# EAGLE design I-GAUGE solar v1-1 (EAGLE 7.5.0)
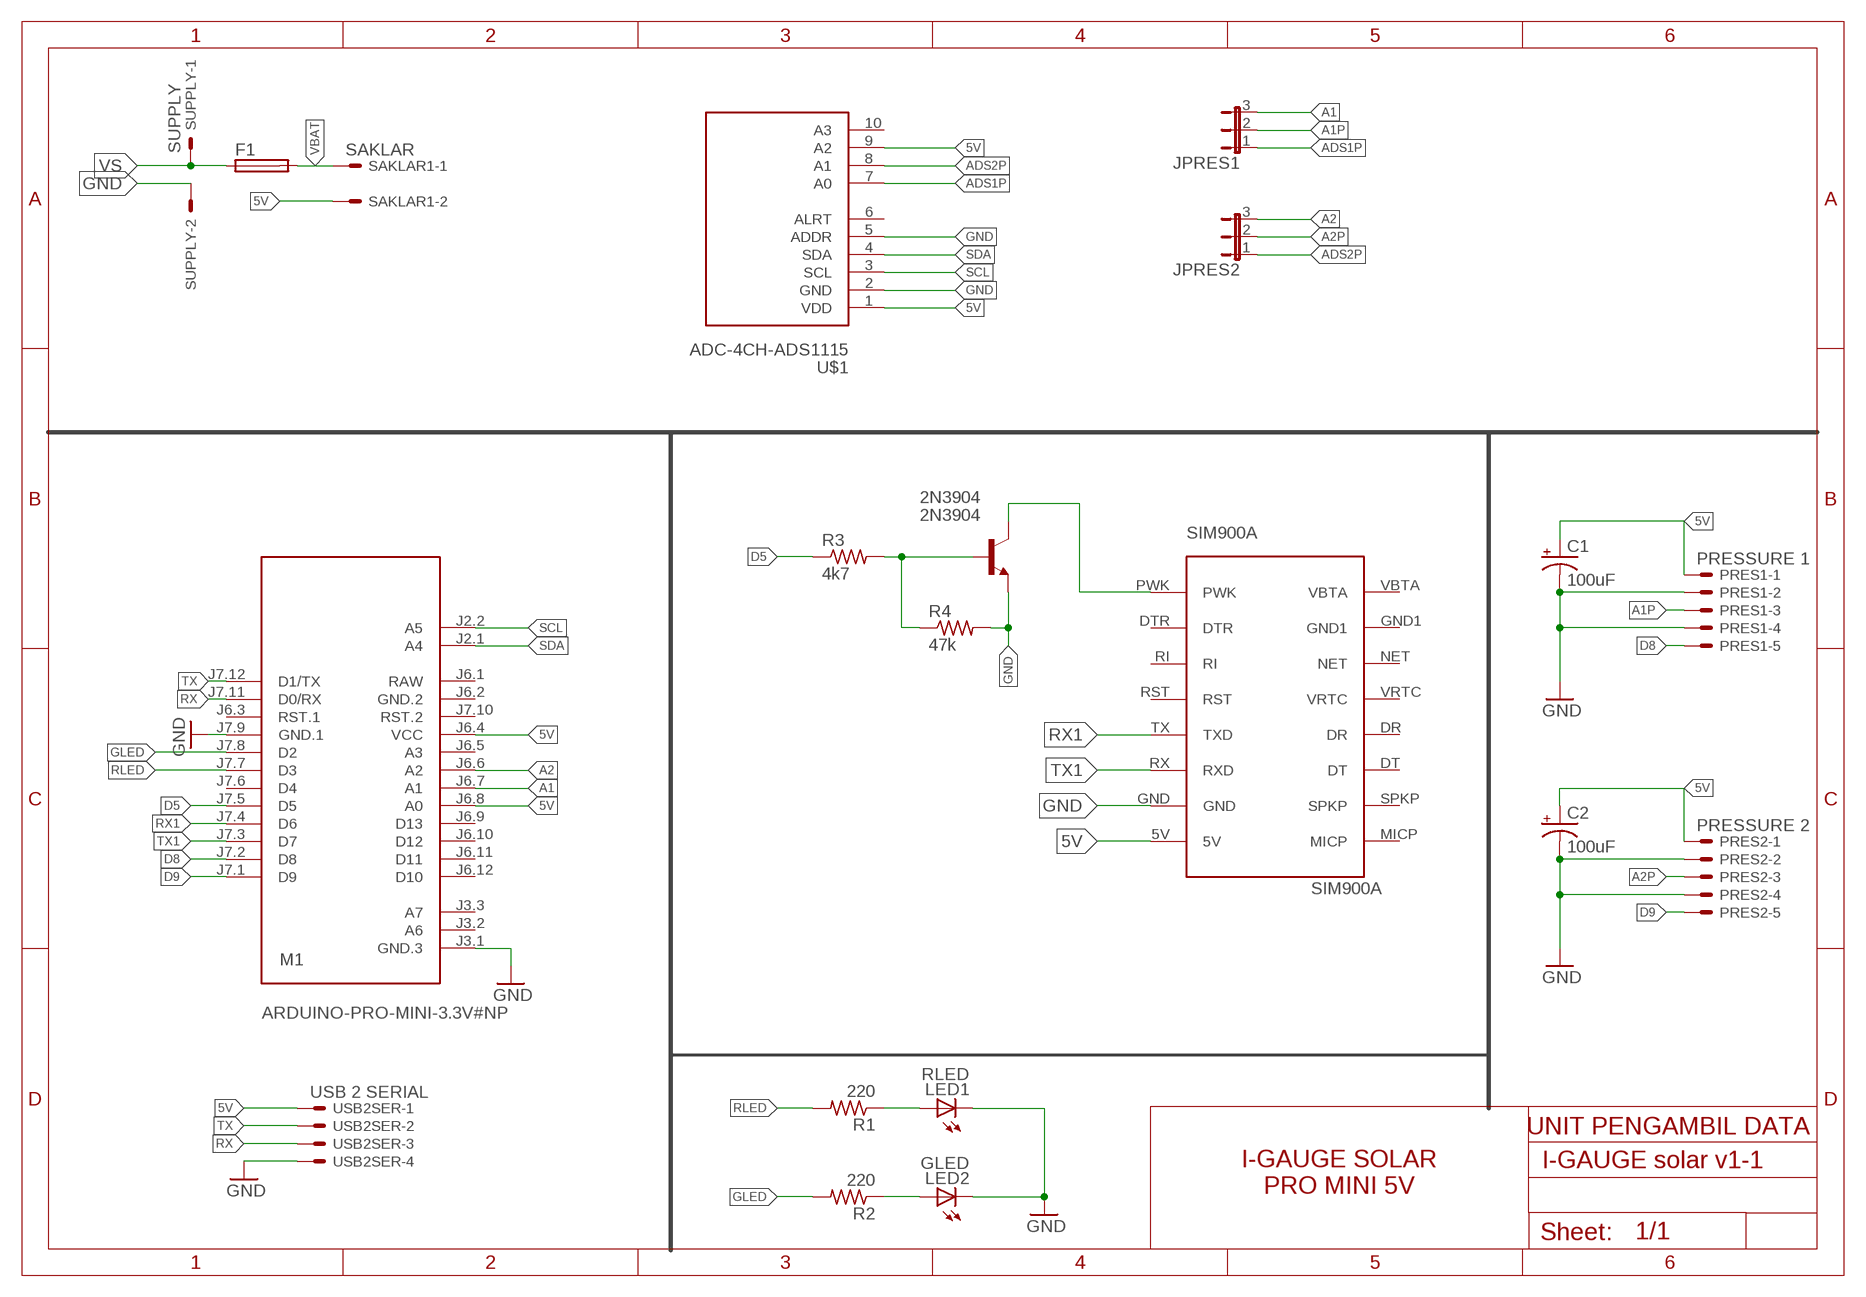
[diagram p0: schematic, sheet 1, part 1 of 2]
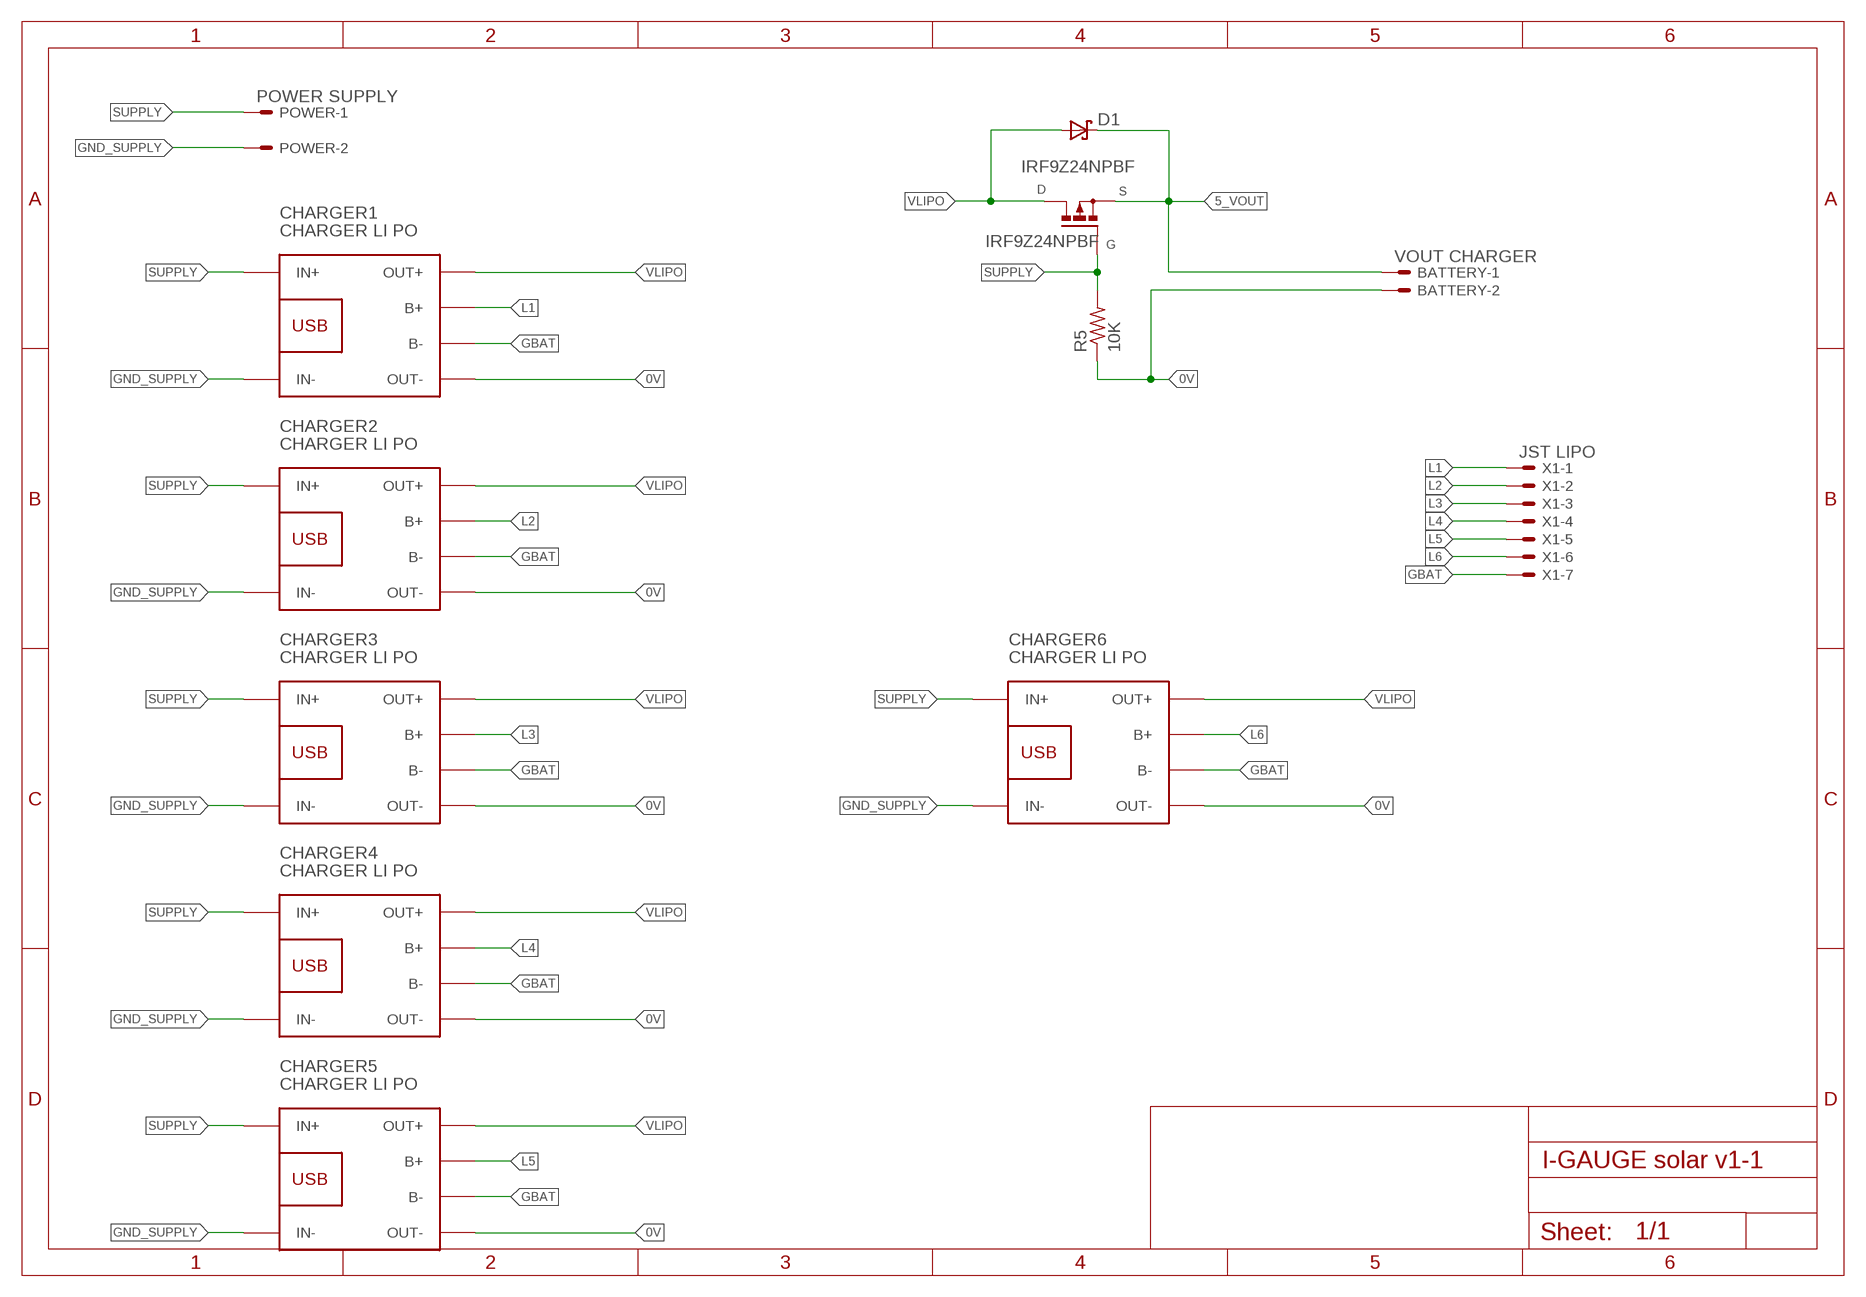
[diagram p1: schematic, sheet 1, part 2 of 2]

## Parts
2N3904  2N3904  [TO92]
BATTERY  VOUT CHARGER  JST-XH-02-PIN-ROUND-PAD  [JST-XH-02-PACKAGE-ROUND-PAD]
C1  100uF  100UF-POLAR-EIA7343-10V-10%(TANT)  [EIA7343]
C2  100uF  100UF-POLAR-EIA7343-10V-10%(TANT)  [EIA7343]
CHARGER1  CHARGER LI PO  BATTERY-CHARGER-LI-PROT  [BATTERY-CHARGER-LI-PROT]
CHARGER2  CHARGER LI PO  BATTERY-CHARGER-LI-PROT  [BATTERY-CHARGER-LI-PROT]
CHARGER3  CHARGER LI PO  BATTERY-CHARGER-LI-PROT  [BATTERY-CHARGER-LI-PROT]
CHARGER4  CHARGER LI PO  BATTERY-CHARGER-LI-PROT  [BATTERY-CHARGER-LI-PROT]
CHARGER5  CHARGER LI PO  BATTERY-CHARGER-LI-PROT  [BATTERY-CHARGER-LI-PROT]
CHARGER6  CHARGER LI PO  BATTERY-CHARGER-LI-PROT  [BATTERY-CHARGER-LI-PROT]
D1  DS_E2L  [E2LINE]
F1  FUSESH22,5  [SH22,5]
IRF9Z24NPBF  IRF9Z24NPBF  PMOSFET_PTO220BH  [TO220BH]
JPRES1  JP2E  [JP2]
JPRES2  JP2E  [JP2]
LED1  RLED  LED5MM  [LED5MM]
LED2  GLED  LED5MM  [LED5MM]
M1  ARDUINO-PRO-MINI-3.3V#NP  [ARDUINO-PRO-MINI#NP]
POWER  POWER SUPPLY  JST-XH-02-PIN-ROUND-PAD  [JST-XH-02-PACKAGE-ROUND-PAD]
PRES1  PRESSURE 1  JST-XH-05-PIN-ROUND-PAD  [JST-XH-05-PACKAGE-ROUND-PAD]
PRES2  PRESSURE 2  JST-XH-05-PIN-ROUND-PAD  [JST-XH-05-PACKAGE-ROUND-PAD]
R1  220  R-US_M1206  [M1206]
R2  220  R-US_M1206  [M1206]
R3  4k7  R-US_R0805  [R0805]
R4  47k  R-US_R0805  [R0805]
R5  10K  R-US_R0805  [R0805]
SAKLAR1  SAKLAR  JST-XH-02-PIN-ROUND-PAD  [JST-XH-02-PACKAGE-ROUND-PAD]
SUPPLY  SUPPLY  JST-XH-02-PIN-ROUND-PAD  [JST-XH-02-PACKAGE-ROUND-PAD]
U$1  ADC-4CH-ADS1115  [ADC-4CH-ADS1115]
U$5  SIM900A  [SIM900A]
USB2SER  USB 2 SERIAL  JST-XH-04-PIN-ROUND-PAD  [JST-XH-04-PACKAGE-ROUND-PAD]
X1  JST LIPO  JST-XH-07-PIN-ROUND-PAD  [JST-XH-07-PACKAGE-ROUND-PAD]

## Nets
0V: BATTERY.2 CHARGER1.OUT- CHARGER2.OUT- CHARGER3.OUT- CHARGER4.OUT- CHARGER5.OUT- CHARGER6.OUT- R5.1
5_VOUT: BATTERY.1 D1.1(K) IRF9Z24NPBF.S
5V: C1.A(+) C2.A(+) M1.J6.4(VCC) M1.J6.8(A0) PRES1.1 PRES2.1 SAKLAR1.2 U$1.1(VDD) U$1.9(A2) U$5.5V USB2SER.1
A1: JPRES1.3 M1.J6.7(A1)
A1P: JPRES1.2 PRES1.3
A2: JPRES2.3 M1.J6.6(A2)
A2P: JPRES2.2 PRES2.3
ADS1P: JPRES1.1 U$1.7(A0)
ADS2P: JPRES2.1 U$1.8(A1)
D5: M1.J7.5(D5) R3.1
D8: M1.J7.2(D8) PRES1.5
D9: M1.J7.1(D9) PRES2.5
GBAT: CHARGER1.B- CHARGER2.B- CHARGER3.B- CHARGER4.B- CHARGER5.B- CHARGER6.B- X1.7
GLED: M1.J7.8(D2) R2.2
GND: 2N3904.3(E) C1.C(-) C2.C(-) LED1.K(C) LED2.K(C) M1.J3.1(GND.3) M1.J7.9(GND.1) PRES1.2 PRES1.4 PRES2.2 PRES2.4 R4.2 SUPPLY.2 U$1.2(GND) U$1.5(ADDR) U$5.GND USB2SER.4
GND_SUPPLY: CHARGER1.IN- CHARGER2.IN- CHARGER3.IN- CHARGER4.IN- CHARGER5.IN- CHARGER6.IN- POWER.2
L1: CHARGER1.B+ X1.1
L2: CHARGER2.B+ X1.2
L3: CHARGER3.B+ X1.3
L4: CHARGER4.B+ X1.4
L5: CHARGER5.B+ X1.5
L6: CHARGER6.B+ X1.6
N$1: 2N3904.1(C) U$5.PWK
N$3: LED1.A R1.1
N$4: LED2.A R2.1
N$7: 2N3904.2(B) R3.2 R4.1
RLED: M1.J7.7(D3) R1.2
RX: M1.J7.11(D0/RX) USB2SER.3
RX1: M1.J7.4(D6) U$5.TX(TXD)
SCL: M1.J2.2(A5) U$1.3(SCL)
SDA: M1.J2.1(A4) U$1.4(SDA)
SUPPLY: CHARGER1.IN+ CHARGER2.IN+ CHARGER3.IN+ CHARGER4.IN+ CHARGER5.IN+ CHARGER6.IN+ IRF9Z24NPBF.G POWER.1 R5.2
TX: M1.J7.12(D1/TX) USB2SER.2
TX1: M1.J7.3(D7) U$5.RX(RXD)
VBAT: F1.2 SAKLAR1.1
VLIPO: CHARGER1.OUT+ CHARGER2.OUT+ CHARGER3.OUT+ CHARGER4.OUT+ CHARGER5.OUT+ CHARGER6.OUT+ D1.2(A) IRF9Z24NPBF.D
VS: F1.1 SUPPLY.1
Unconnected: M1.J3.2(A6) M1.J3.3(A7) M1.J6.3(RST.1) M1.J6.5(A3) M1.J6.9(D13) M1.J6.10(D12) M1.J6.11(D11) M1.J6.12(D10) M1.J7.6(D4) M1.J7.10(RST.2) U$1.6(ALRT) U$1.10(A3) U$5.DR U$5.DT U$5.DTR U$5.GND1 U$5.MICP U$5.NET U$5.RI U$5.RST U$5.SPKP U$5.VBTA U$5.VRTC

## Notes on the sheet
- D | S
- G
- UNIT PENGAMBIL DATA
- I-GAUGE SOLAR
  PRO MINI 5V

## Power pins joined to a net without a drawn wire
GND.2: M1.J6.2(GND.2)
RAW: M1.J6.1(RAW)

## Library data of the parts
2N3904 = transistor:2N3904: NPN TRANSISTOR
BATTERY POWER SAKLAR1 SUPPLY = jst XH:JST-XH-02-PIN: JST XH Connector 2 Pin Wire to board connector. Pitch: 2,54 mm, (0.100") Number of pins: 2 Created by Rembrandt Electronics www.rembrandtelectronics.com
C1 C2 = SparkFun-Capacitors:100UF-POLAR: 100µF polarized capacitors A capacitor is a passive two-terminal electrical component used to store electrical energy temporarily in an electric field.; PROD_ID: CAP-07890
CHARGER1-CHARGER6 = diy-modules:BATTERY-CHARGER-LI-PROT: Lithium Battery 5V Charger with protection circuit More details available here: http://www.instructables.com/id/DIY-Lithium-ion-Battery-Charger/step4/TP4056-based-lithium-ion-battery-charger-module/ Click here to find device on ebay.com <http://www.ebay.com/sch/tp4056+charger+usb+protection>
D1 = zetex:DS_E2L: SHOTTKY DIODE; OC_FARNELL: unknown; OC_NEWARK: unknown
F1 = fuse:FUSE: Fuse; OC_FARNELL: unknown; OC_NEWARK: unknown
IRF9Z24NPBF = transistor-power:PMOSFET_P: Power MOSFET P-Channel
JPRES1 JPRES2 = jumper:JP2E: JUMPER
LED1 LED2 = adafruit:LED: LED OSRAM: - CHIPLED LG R971, LG N971, LY N971, LG Q971, LY Q971, LO R971, LY R971 LH N974, LH R974 LS Q976, LO Q976, LY Q976 LO Q996 - Hyper CHIPLED LW Q18S LB Q993, LB Q99A, LB R99A - SideLED LS A670, LO A670, LY A670, LG A670, LP A670 LB A673, LV A673, LT A673, LW A673 LH A674 LY A675 LS A676, LA A676, LO A676, LY A676, LW A676 LS A679, LY A679, LG A679 - Hyper Micro SIDELED® LS Y876, LA Y876, LO Y876, LY Y876 LT Y87S - SmartLED LW L88C, LW L88S LB L89C, LB L89S, LG L890 LS L89K, LO L89K, LY L89K LS L896, LA L896, LO L896, LY L896 - TOPLED LS T670, LO T670, LY T670, LG T670, LP T670 LSG T670, LSP T670, LSY T670, LOP T670, LYG T670 LG T671, LOG T671, LSG T671 LB T673, LV T673, LT T673, LW T673 LH T674 LS T676, LA T676, LO T676, LY T676, LB T676, LH T676, LSB T676, LW T676 LB T67C, LV T67C, LT T67C, LS T67K, LO T67K, LY T67K, LW E67C LS E67B, LA E67B, LO E67B, LY E67B, LB E67C, LV E67C, LT E67C LW T67C LS T679, LY T679, LG T679 LS T770, LO T770, LY T770, LG T770, LP T770 LB T773, LV T773, LT T773, LW T773 LH T774 LS E675, LA E675, LY E675, LS T675 LS T776, LA T776, LO T776, LY T776, LB T776 LHGB T686 LT T68C, LB T68C - Hyper Mini TOPLED® LB M676 - Mini TOPLED Santana® LG M470 LS M47K, LO M47K, LY M47K Source: http://www.osram.convergy.de/
M1 = Arduino Board:ARDUINO-PRO-MINI-*#NP: Arduino Pro Mini (and compatible devices) without programming pads More details available here: https://www.arduino.cc/en/Main/ArduinoBoardProMini Click here to find device on ebay.com <http://www.ebay.com/sch/arduino+pro+mini>
PRES1 PRES2 = jst XH:JST-XH-05-PIN: JST XH Connector 2 Pin Wire to board connector. Pitch: 2,54 mm, (0.100") Number of pins: 5 Created by Rembrandt Electronics www.rembrandtelectronics.com
R1 R2 = resistor:R-US_: RESISTOR, American symbol
R3-R5 = rcl:R-US_: RESISTOR, American symbol
U$1 = diy-modules:ADC-4CH-ADS1115: 4 Channel 16-Bit Analog-to-Digital Converter based on ADS1115 chip Arduino ADS1115 Getting Started Tutorial is available here: http://henrysbench.capnfatz.com/henrys-bench/arduino-voltage-measurements/arduino-ads1115-module-getting-started-tutorial/ ADS1115 datasheet is available here: http://www.ti.com/lit/ds/symlink/ads1115.pdf Click here to find device on ebay.com <http://www.ebay.com/sch/ads1115+module>
U$5 = SIM900A GSM MODULE:SIM900A
USB2SER = jst XH:JST-XH-04-PIN: JST XH Connector 2 Pin Wire to board connector. Pitch: 2,54 mm, (0.100") Number of pins: 4 Created by Rembrandt Electronics www.rembrandtelectronics.com
X1 = jst XH:JST-XH-07-PIN: JST XH Connector 2 Pin Wire to board connector. Pitch: 2,54 mm, (0.100") Number of pins: 7 Created by Rembrandt Electronics www.rembrandtelectronics.com

## Board
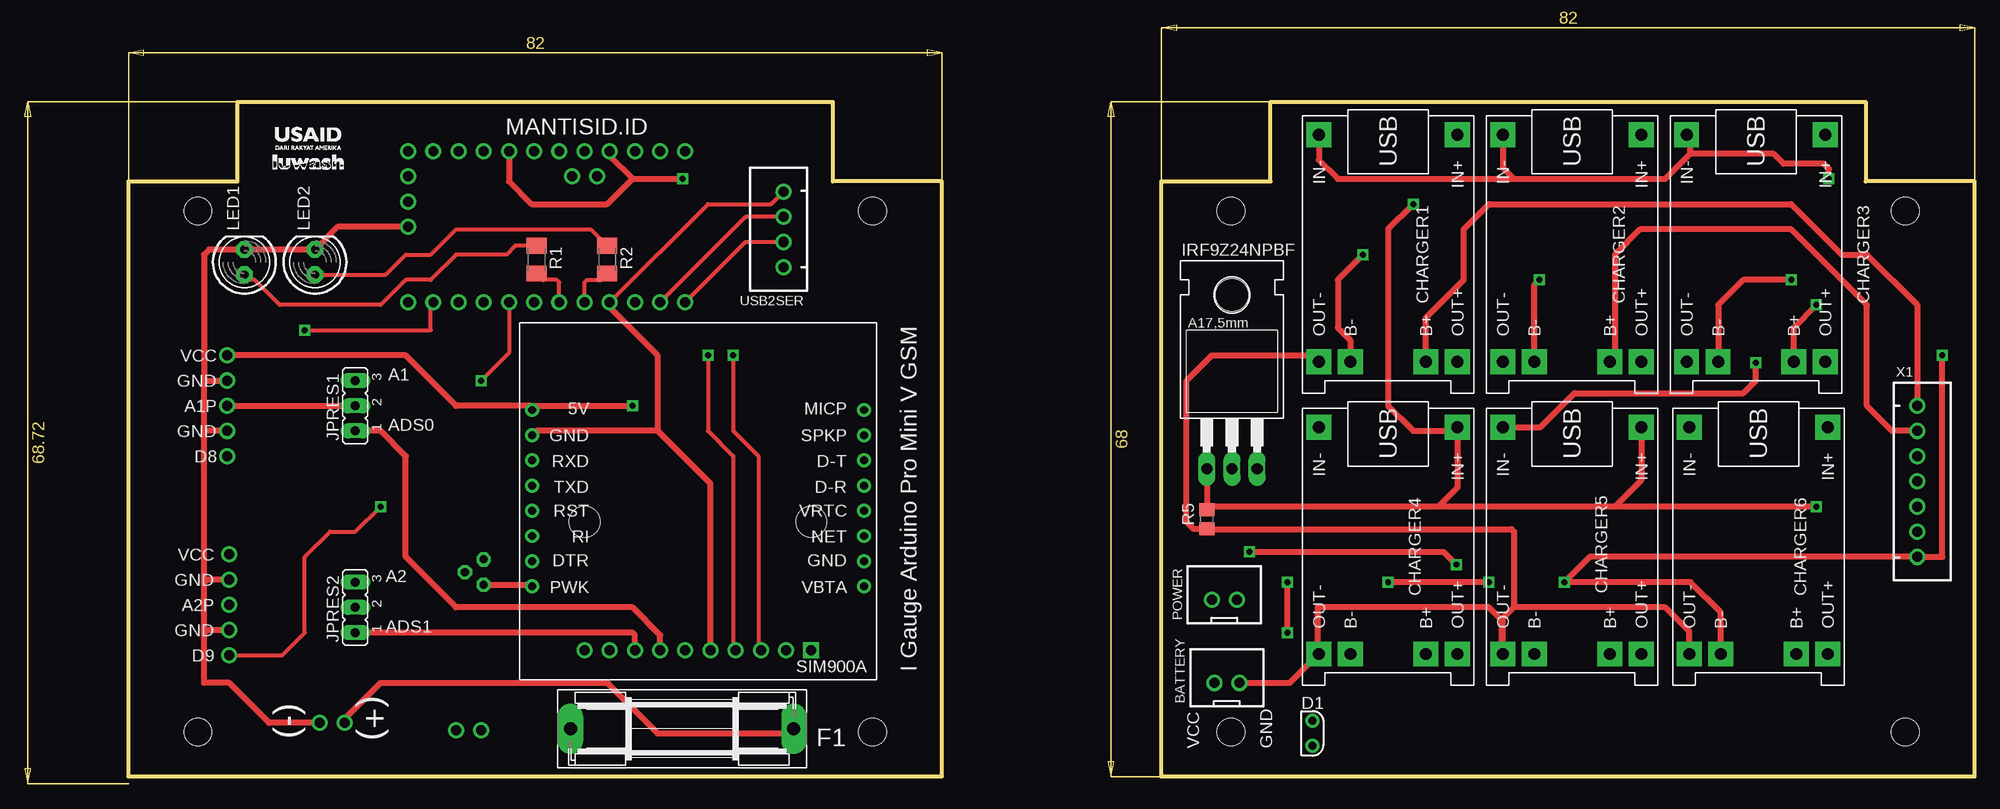
[diagram p2: board, top side]
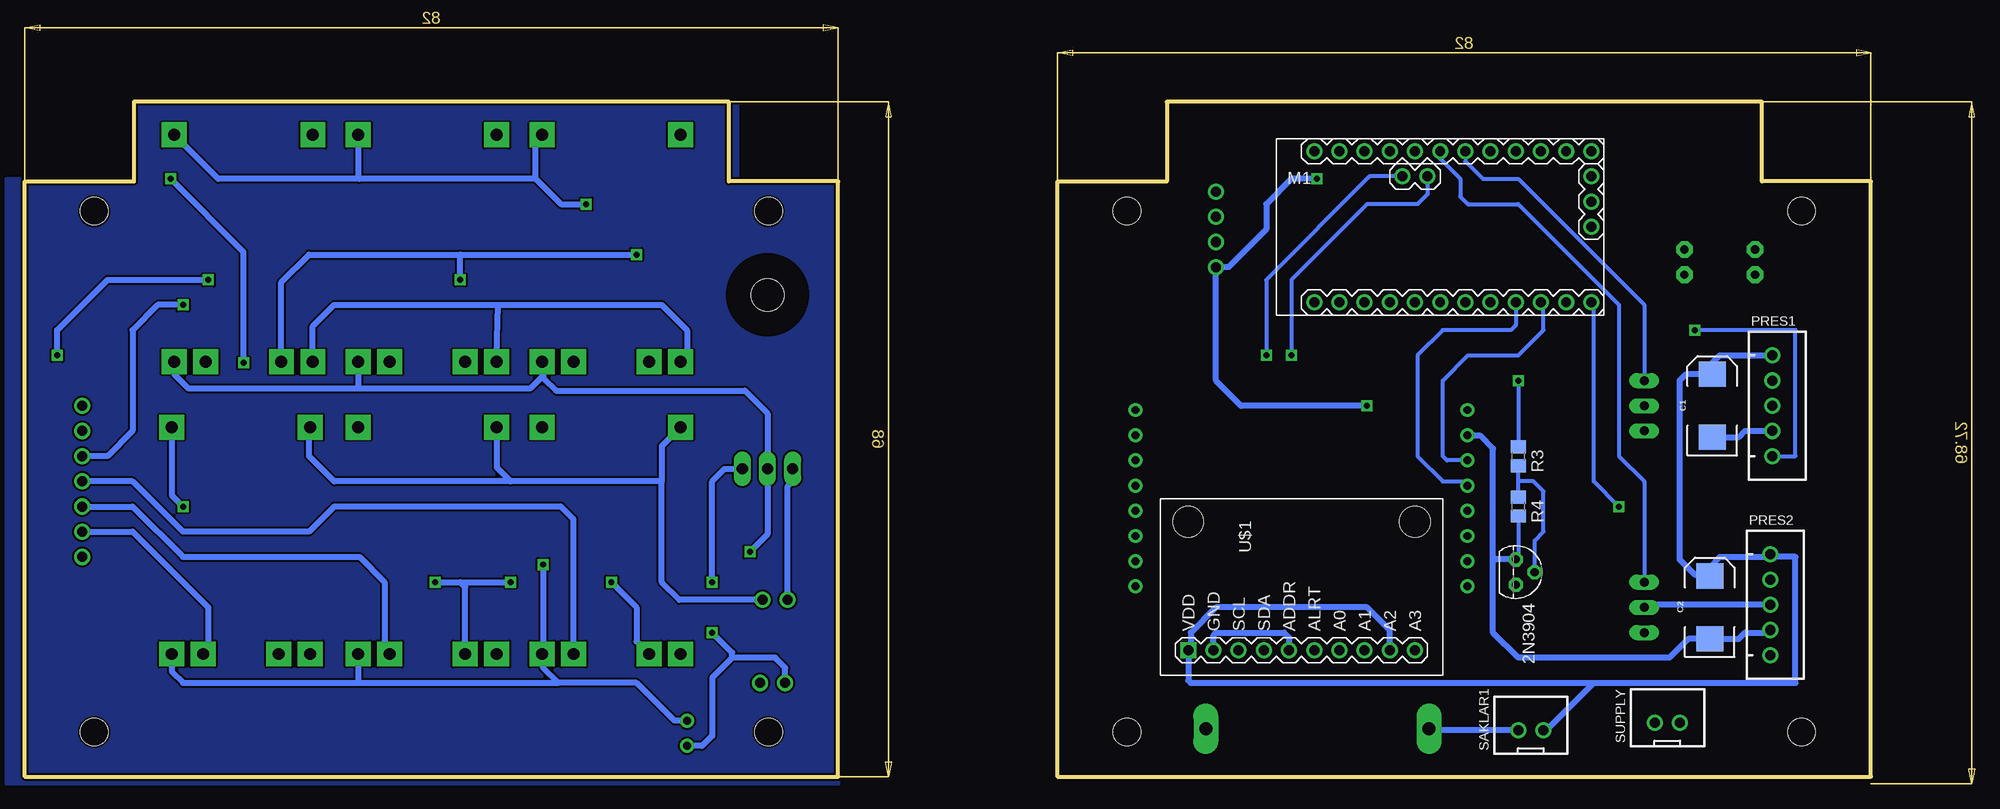
[diagram p3: board, bottom side, seen from below]

Size 186.14 x 68 mm. Coordinates in mm from the lower left corner, seen from the top.
Outline: 82,0 82,60 71,60 71,68 11,68 11,60 0,60 0,0 82,0
Outline: 104.14,60 115.14,60 115.14,68 175.14,68 175.14,60 186.14,60 186.14,0 104.14,0 104.14,60
Copper layers (1*16): Top 0.035mm / dielectric 1.5mm / Bottom 0.035mm
Design rules "SparkFun": minimum track width 8mil, minimum drill 20mil, track to track 8mil, track to pad 8mil, pad to pad 8mil, via to via 8mil, smd to smd 8mil, copper to edge 8mil, drill to drill 8mil, minimum pad ring 12mil, minimum via ring 10mil, stop-mask expansion 4mil, vias tented up to drill 20mil, thermal gap 10mil
Holes 2.8 mm at 75,4.5 7,4.5 75,57 7,57 179.14,4.5 111.14,4.5 111.14,57 179.14,57

### Footprints (pad centres in the part's own frame; a part is rotated, then mirrored left to right if it is on the bottom)
TO92 = drill 0.813 octagon: 1 1.27,0; 2 0,1.905; 3 -1.27,0
JST-XH-02-PACKAGE-ROUND-PAD = drill 1.016: 1 -1.27,0; 2 1.27,0
EIA7343 = smd 2.55 x 2.7: A 3.17,0; C -3.17,0
BATTERY-CHARGER-LI-PROT = drill 1.2 pad 2.5 square: B+ 10.795,3.81; B- 10.795,-3.81; IN+ -12.065,6.985; IN- -12.065,-6.985; OUT+ 10.795,6.985; OUT- 10.795,-6.985
E2LINE = drill 0.8 pad 1.397: 1 0,-1.27; 2 0,1.27
SH22,5 = drill 1.321 pad 2.54 long: 1 -11.252,0; 2 11.252,0
TO220BH = drill 1.118 long: D 0,-6.35; G -2.54,-6.35; S 2.54,-6.35 | hole 3.302: 0,11.176
JP2 = drill 0.914 long: 1 -2.54,0; 2 0,0; 3 2.54,0
LED5MM = drill 0.813 pad 1.676 octagon: A -1.27,0; K 1.27,0
ARDUINO-PRO-MINI#NP = drill 1: J2.1 -1.27,5.08; J2.2 -3.81,5.08; J3.1 15.24,0; J3.2 15.24,2.54; J3.3 15.24,5.08; J6.1 -12.7,7.62; J6.2 -10.16,7.62; J6.3 -7.62,7.62; J6.4 -5.08,7.62; J6.5 -2.54,7.62; J6.6 0,7.62; J6.7 2.54,7.62; J6.8 5.08,7.62; J6.9 7.62,7.62; J6.10 10.16,7.62; J6.11 12.7,7.62; J6.12 15.24,7.62; J7.1 15.24,-7.62; J7.2 12.7,-7.62; J7.3 10.16,-7.62; J7.4 7.62,-7.62; J7.5 5.08,-7.62; J7.6 2.54,-7.62; J7.7 0,-7.62; J7.8 -2.54,-7.62; J7.9 -5.08,-7.62; J7.10 -7.62,-7.62; J7.11 -10.16,-7.62; J7.12 -12.7,-7.62
JST-XH-05-PACKAGE-ROUND-PAD = drill 1.016: 1 -5.08,0; 2 -2.54,0; 3 0,0; 4 2.54,0; 5 5.08,0
M1206 = smd 1.6 x 2: 1 -1.4,0; 2 1.4,0
R0805 = smd 1.3 x 1.5: 1 -0.95,0; 2 0.95,0
ADC-4CH-ADS1115 = drill 1 square: 1 -6.35,11.43 | drill 1: 2 -6.35,8.89; 3 -6.35,6.35; 4 -6.35,3.81; 5 -6.35,1.27; 6 -6.35,-1.27; 7 -6.35,-3.81; 8 -6.35,-6.35; 9 -6.35,-8.89; 10 -6.35,-11.43 | hole 3.1: 6.604,11.43; 6.604,-11.43
SIM900A = drill 0.8: 5V 34.73,8.81; DR 1.27,16.43; DT 1.27,13.89; DTR 34.73,24.05; GND 34.73,11.35; GND1 1.27,24.05; MICP 1.27,8.81; NET 1.27,21.51; PWK 34.73,26.59; RI 34.73,21.51; RST 34.73,18.97; RX 34.73,13.89; SPKP 1.27,11.35; TX 34.73,16.43; VBTA 1.27,26.59; VRTC 1.27,18.97
JST-XH-04-PACKAGE-ROUND-PAD = drill 1.016: 1 -3.81,0; 2 -1.27,0; 3 1.27,0; 4 3.81,0
JST-XH-07-PACKAGE-ROUND-PAD = drill 1.016: 1 -7.62,0; 2 -5.08,0; 3 -2.54,0; 4 0,0; 5 2.54,0; 6 5.08,0; 7 7.62,0

### Placement (x,y rotation side)
2N3904  35.81,20.62 270 bottom
BATTERY  110.74,9.44 0 top
C1  16,37.38 90 bottom
C2  16.26,17.06 90 bottom
CHARGER1  127,52.62 270 top
CHARGER2  145.54,52.62 270 top
CHARGER3  164.08,52.62 270 top
CHARGER4  127,23.16 270 top
CHARGER5  145.54,23.16 270 top
CHARGER6  164.34,23.16 270 top
D1  119.38,4.36 0 top
F1  55.81,4.83 180 top
IRF9Z24NPBF  111.25,37.38 0 top
JPRES1  22.86,37.38 90 top
JPRES2  22.86,17.06 90 top
LED1  11.68,51.86 90 top
LED2  18.8,51.86 90 top
M1  43.43,55.41 0 bottom
POWER  110.49,17.82 0 top
PRES1  9.95,37.38 270 bottom
PRES2  10.16,17.31 270 bottom
R1  41.15,52.11 270 top
R2  48.26,52.11 270 top
R3  35.56,32.3 270 bottom
R4  35.56,27.22 270 bottom
R5  108.71,25.95 90 top
SAKLAR1  34.29,4.66 0 bottom
SUPPLY  20.52,5.43 0 bottom
U$1  57.4,19.09 90 bottom
U$5  75.44,45.76 180 top
USB2SER  66.04,55.16 90 top
X1  180.34,29.76 270 top

### Tracks (layer width: path | path; a pad name or v marks a point on that pad's centre or on a via)
0V
  Top 0.61: BATTERY.2 117.09,9.44 119.89,12.23 | 119.89,12.23 CHARGER4.OUT- | 119.89,12.23 119.89,17.06 137.16,17.06 138.56,15.66 CHARGER5.OUT- 138.43,12.49 138.43,15.79 139.7,17.06 | 108.78,24.93 R5.1 | CHARGER6.OUT- 157.35,14.65 154.94,17.06 139.7,17.06 | 108.78,24.93 139.45,24.93 139.7,24.68 139.7,17.06 | 108.78,24.93 107.44,24.93 106.68,25.7 106.68,39.92 109.22,42.46 119.38,42.46 CHARGER1.OUT-
  Bottom 0.61: CHARGER3.OUT- 157.1,45.38 154.94,47.54 138.43,47.54 | 138.43,47.54 121.92,47.54 119.38,45 119.38,42.46 CHARGER1.OUT- | CHARGER2.OUT- 138.56,42.33 138.43,47.54
5_VOUT  (via drill 0.6)
  Top 0.61: v116.84,14.52 v116.84,19.6
  Bottom 0.61: BATTERY.1 109.47,10.96 110.49,11.98 114.81,11.98 | 114.81,11.98 116.84,9.95 116.84,4.11 117.86,3.09 D1.1 | 114.81,11.98 114.81,12.49 v116.84,14.52 | v116.84,19.6 116.84,29.76 115.57,31.03 IRF9Z24NPBF.S
5V  (via drill 0.6)
  Top 0.61: M1.J6.4 48.51,62.53 50.8,60.24 | 50.8,60.24 v55.88,60.24 | M1.J6.8 38.35,59.99 40.64,57.7 48.26,57.7 50.8,60.24 | U$5.5V 40.71,37.31 40.64,37.38 | 40.64,37.38 33.02,37.38 27.94,42.46 PRES1.1 | 40.64,37.38 v50.8,37.38
  Bottom 0.61: PRES1.1 15.24,42.46 16,41.7 C1.A 18.67,40.55 19.3,39.92 19.3,21.89 17.78,20.36 16.39,20.36 C2.A 16.26,21.12 15.24,22.14 10.41,22.14 PRES2.1 9.91,22.14 7.62,22.14 7.62,9.44 27.94,9.44 | SAKLAR1.2 32.72,4.67 27.94,9.44 | 27.94,9.44 68.58,9.44 68.83,9.69 U$1.1 68.58,13 68.58,14.52 66.04,17.06 50.8,17.06 48.51,14.77 U$1.9 | v55.88,60.24 58.42,60.24 60.96,57.7 60.96,55.16 64.77,51.35 USB2SER.1 66.04,39.92 63.5,37.38 v50.8,37.38
A1
  Bottom 0.406: M1.J6.7 40.89,62.02 39.12,60.24 35.56,60.24 22.86,47.54 JPRES1.3
A1P
  Top 0.61: PRES1.3 JPRES1.2
A2
  Bottom 0.406: M1.J6.6 43.43,62.27 41.4,60.24 41.4,58.46 40.64,57.7 35.56,57.7 25.4,47.54 25.4,32.3 22.86,29.76 JPRES2.3
A2P
  Bottom 0.61: PRES2.3 22.61,17.31 JPRES2.2
ADS1P
  Top 0.61: U$1.7 53.59,14.27 50.8,17.06 33.02,17.06 27.94,22.14 27.94,32.3 25.4,34.84 JPRES1.1
ADS2P
  Top 0.61: U$1.8 51.05,14.27 50.8,14.52 JPRES2.1
D5  (via drill 0.6)
  Top 0.406: M1.J7.5 38.35,42.71 v35.56,39.92
  Bottom 0.406: v35.56,39.92 R3.1
D8  (via drill 0.6)
  Top 0.406: v17.78,45 30.48,45 30.48,47.54 M1.J7.2
  Bottom 0.406: PRES1.5 7.62,32.3 7.62,45 v17.78,45
D9  (via drill 0.6)
  Top 0.406: PRES2.5 15.49,12.23 17.78,14.52 17.78,22.14 20.32,24.68 22.86,24.68 v25.4,27.22
  Bottom 0.406: v25.4,27.22 27.94,29.76 27.94,47.54 M1.J7.1
GBAT  (via drill 0.6)
  Top 0.61: v124.46,52.62 121.92,50.08 121.92,45.25 123.19,43.98 CHARGER1.B- | CHARGER2.B- 141.73,49.57 v142.24,50.08 | CHARGER6.B- 160.53,16.55 157.48,19.6 v144.78,19.6 147.32,22.14 X1.7 182.88,22.14 v182.88,42.46 | v137.16,19.6 v127,19.6 | v167.64,50.08 162.81,50.08 160.27,47.54 CHARGER3.B-
  Bottom 0.61: CHARGER3.B- 160.27,49.83 157.48,52.62 142.24,52.62 | 142.24,52.62 v124.46,52.62 | v142.24,50.08 142.24,52.62 | v144.78,19.6 142.24,19.6 | 142.24,19.6 v137.16,19.6 | v127,19.6 124.46,17.06 124.46,13.63 CHARGER4.B- | CHARGER5.B- 141.73,19.09 142.24,19.6 | v182.88,42.46 182.88,45 177.8,50.08 v167.64,50.08
GLED
  Top 0.406: M1.J7.8 45.97,49.83 46.23,50.08 47.63,50.08 R2.2
GND
  Top 0.406: M1.J7.9 58.42,57.7 64.77,57.7 USB2SER.4
  Top 0.61: M1.J3.1 21.08,55.41 LED2.K LED1.K 8.13,53.13 7.62,52.62 7.62,39.92 | 7.62,39.92 PRES1.2 | PRES1.4 7.62,34.84 | 7.62,34.84 7.62,39.92 | PRES2.2 7.87,19.85 7.62,19.6 | 7.62,19.6 7.62,34.84 | PRES2.4 7.87,14.77 7.62,14.52 | 7.62,14.52 7.62,19.6 | SUPPLY.2 14.17,5.43 10.16,9.44 7.62,9.44 7.62,14.52 | U$1.5 58.67,29.51 53.34,34.84 | 53.34,34.84 41.14,34.84 U$5.GND | M1.J7.9 48.51,47.29 53.34,42.46 53.34,34.84
  Bottom 0.406: R4.2 35.56,22.14 2N3904.3
  Bottom 0.61: PRES2.4 10.41,14.52 12.7,14.52 13.33,13.89 C2.C 18.41,13.89 20.32,11.98 35.56,11.98 38.1,14.52 38.1,22.14 | C1.C 13.33,34.21 12.7,34.84 PRES1.4 | 2N3904.3 37.85,21.89 38.1,22.14 | 38.1,22.14 38.1,33.06 39.37,34.33 40.63,34.33 U$5.GND | U$1.2 66.29,14.27 66.04,14.52 59.18,14.52 58.67,14.01 U$1.5
GND_SUPPLY  (via drill 0.6)
  Top 0.61: CHARGER1.IN- 120.02,62.15 121.92,60.24 139.7,60.24 | 139.7,60.24 154.94,60.24 157.48,62.78 | 157.48,62.78 157.48,64.3 CHARGER3.IN- | CHARGER2.IN- 138.56,61.38 139.7,60.24 | CHARGER5.IN- 142.37,35.22 145.8,38.65 162.81,38.65 164.08,39.92 v164.08,41.7 | v171.45,60.24 171.45,61.26 170.94,61.76 166.88,61.76 165.86,62.78 157.48,62.78
  Bottom 0.61: POWER.2 120.14,17.82 121.92,19.6 121.92,29.76 | CHARGER4.IN- 121.92,33.32 121.92,29.76 | 121.92,29.76 137.16,29.76 | 137.16,29.76 154.94,29.76 157.48,32.3 157.48,35.09 CHARGER6.IN- | CHARGER5.IN- 138.56,31.16 137.16,29.76 | v164.08,41.7 164.08,52.87 v171.45,60.24
L1
  Top 0.61: CHARGER1.B+ 130.81,46.27 134.62,50.08 134.62,55.16 137.16,57.7 167.64,57.7 172.72,52.62 175.26,52.62 180.34,47.54 X1.1
L2
  Top 0.61: X1.2 177.8,34.84 175.26,37.38 175.26,47.54 167.64,55.16 152.4,55.16 149.86,52.62 149.86,42.33 CHARGER2.B+
L3  (via drill 0.6)
  Top 0.61: CHARGER3.B+ 167.89,45.25 v170.18,47.54
  Bottom 0.61: v170.18,47.54 172.72,47.54 175.26,45 175.26,34.84 177.8,32.3 X1.3
L4
  Bottom 0.61: CHARGER4.B+ 130.81,25.95 132.08,27.22 154.94,27.22 157.48,24.68 170.18,24.68 175.26,29.76 X1.4
L5
  Bottom 0.61: X1.5 175.26,27.22 170.18,22.14 152.4,22.14 149.86,19.6 149.86,12.87 CHARGER5.B+
L6
  Bottom 0.61: X1.6 175.26,24.68 167.64,17.06 167.64,12.87 CHARGER6.B+
N$1
  Top 0.61: 2N3904.1 40.53,19.35 U$5.PWK
N$3
  Top 0.406: R1.1 38.99,53.51 38.1,52.62 33.02,52.62 30.48,50.08 27.94,50.08 25.4,47.54 15.24,47.54 12.7,50.08 12.19,50.08 LED1.A
N$4
  Top 0.406: LED2.A 25.91,50.59 27.94,52.62 30.48,52.62 33.02,55.16 46.61,55.16 R2.1
N$5
  pour Bottom: 104.14,-0.72 187.96,-0.72 187.96,60.24 175.26,60.24 175.26,67.86 114.3,67.86 114.3,60.24 104.14,60.24
N$7
  Bottom 0.406: R4.1 35.56,29.76 | 35.56,29.76 R3.2 | 2N3904.2 33.91,23.79 33.02,24.68 33.02,28.74 34.04,29.76 35.56,29.76
RLED
  Top 0.406: M1.J7.7 43.43,49.83 43.18,50.08 41.78,50.08 R1.2
RX
  Top 0.406: USB2SER.3 62.23,56.43 M1.J7.11
RX1
  Bottom 0.406: M1.J7.4 35.81,45.51 36.32,45 43.18,45 45.72,42.46 45.72,32.3 43.18,29.76 41.14,29.76 U$5.TX
SCL  (via drill 0.6)
  Top 0.406: v60.96,42.46 60.96,34.84 63.5,32.3 63.5,13 U$1.3
  Bottom 0.406: M1.J2.2 50.55,60.49 60.96,50.08 v60.96,42.46
SDA  (via drill 0.6)
  Top 0.406: v58.42,42.46 58.42,34.84 60.96,32.3 60.96,13 U$1.4
  Bottom 0.406: M1.J2.1 44.7,58.72 45.72,57.7 50.8,57.7 58.42,50.08 v58.42,42.46
SUPPLY  (via drill 0.6)
  Top 0.61: 132.08,27.22 133.99,29.12 CHARGER4.IN+ 133.6,34.84 129.54,34.84 127,37.38 127,55.16 v129.54,57.7 | IRF9Z24NPBF.G R5.2 109.03,27.22 132.08,27.22 | CHARGER5.IN+ 152.53,29.89 149.86,27.22 | 149.86,27.22 132.08,27.22 | v170.18,27.22 149.86,27.22
  Bottom 0.61: 134.62,60.24 152.4,60.24 | 152.4,60.24 166.62,60.24 CHARGER3.IN+ | CHARGER2.IN+ 152.53,60.37 152.4,60.24 | POWER.1 109.22,29.25 108.71,29.76 IRF9Z24NPBF.G | CHARGER6.IN+ 171.32,28.36 v170.18,27.22 | 134.62,60.24 132.08,57.7 v129.54,57.7 | 134.62,60.24 134.62,64.05 CHARGER1.IN+
TX
  Top 0.406: M1.J7.12 62.23,53.89 USB2SER.2
TX1
  Bottom 0.406: U$5.RX 42.75,31.87 43.18,32.3 43.18,39.92 40.64,42.46 35.56,42.46 33.02,45 33.02,47.54 M1.J7.3
VBAT
  Bottom 0.61: SAKLAR1.1 44.39,4.67 F1.2
VLIPO  (via drill 0.6)
  Top 0.61: v113.03,22.65 132.59,22.65 v133.86,21.38
  Bottom 0.61: D1.2 120.65,5.63 124.46,9.44 132.33,9.44 | 132.33,9.44 133.86,10.96 133.86,12.23 CHARGER4.OUT+ 133.86,12.49 v133.86,21.38 | CHARGER5.OUT+ 152.53,9.57 152.4,9.44 | 152.4,9.44 132.33,9.44 | CHARGER6.OUT+ 171.32,10.58 170.18,9.44 152.4,9.44 | CHARGER3.OUT+ 171.07,40.56 169.67,39.16 152.4,39.16 | 152.4,39.16 135.13,39.16 133.86,40.43 | 133.86,40.43 133.86,41.7 CHARGER1.OUT+ | CHARGER2.OUT+ 152.53,39.28 152.4,39.16 | 133.86,40.43 133.86,40.17 132.59,38.9 113.54,38.9 111.25,36.62 IRF9Z24NPBF.D 111.25,24.43 v113.03,22.65
VS
  Top 0.61: SUPPLY.1 21.79,5.83 25.4,9.44 48.26,9.44 53.34,4.36 66.59,4.36 F1.1

### Text on the board
tPlace: VCC | GND | A1 | A1P | GND | ADS0 | D8 | VCC | GND | A2 | A2P | GND | ADS1 | D9 | (+) | (-) | VCC | GND
tNames: MANTISID.ID | I Gauge Arduino Pro Mini V GSM